# Altium schematic sheet MainProcessor.SchDoc
size 420 x 297 mm; SheetNumber: 1; SheetTotal: 7; ENG_APP_DATE: --/--/--; DSN_APP_DATE: --/--/--; CHK_APP_DATE: --/--/--
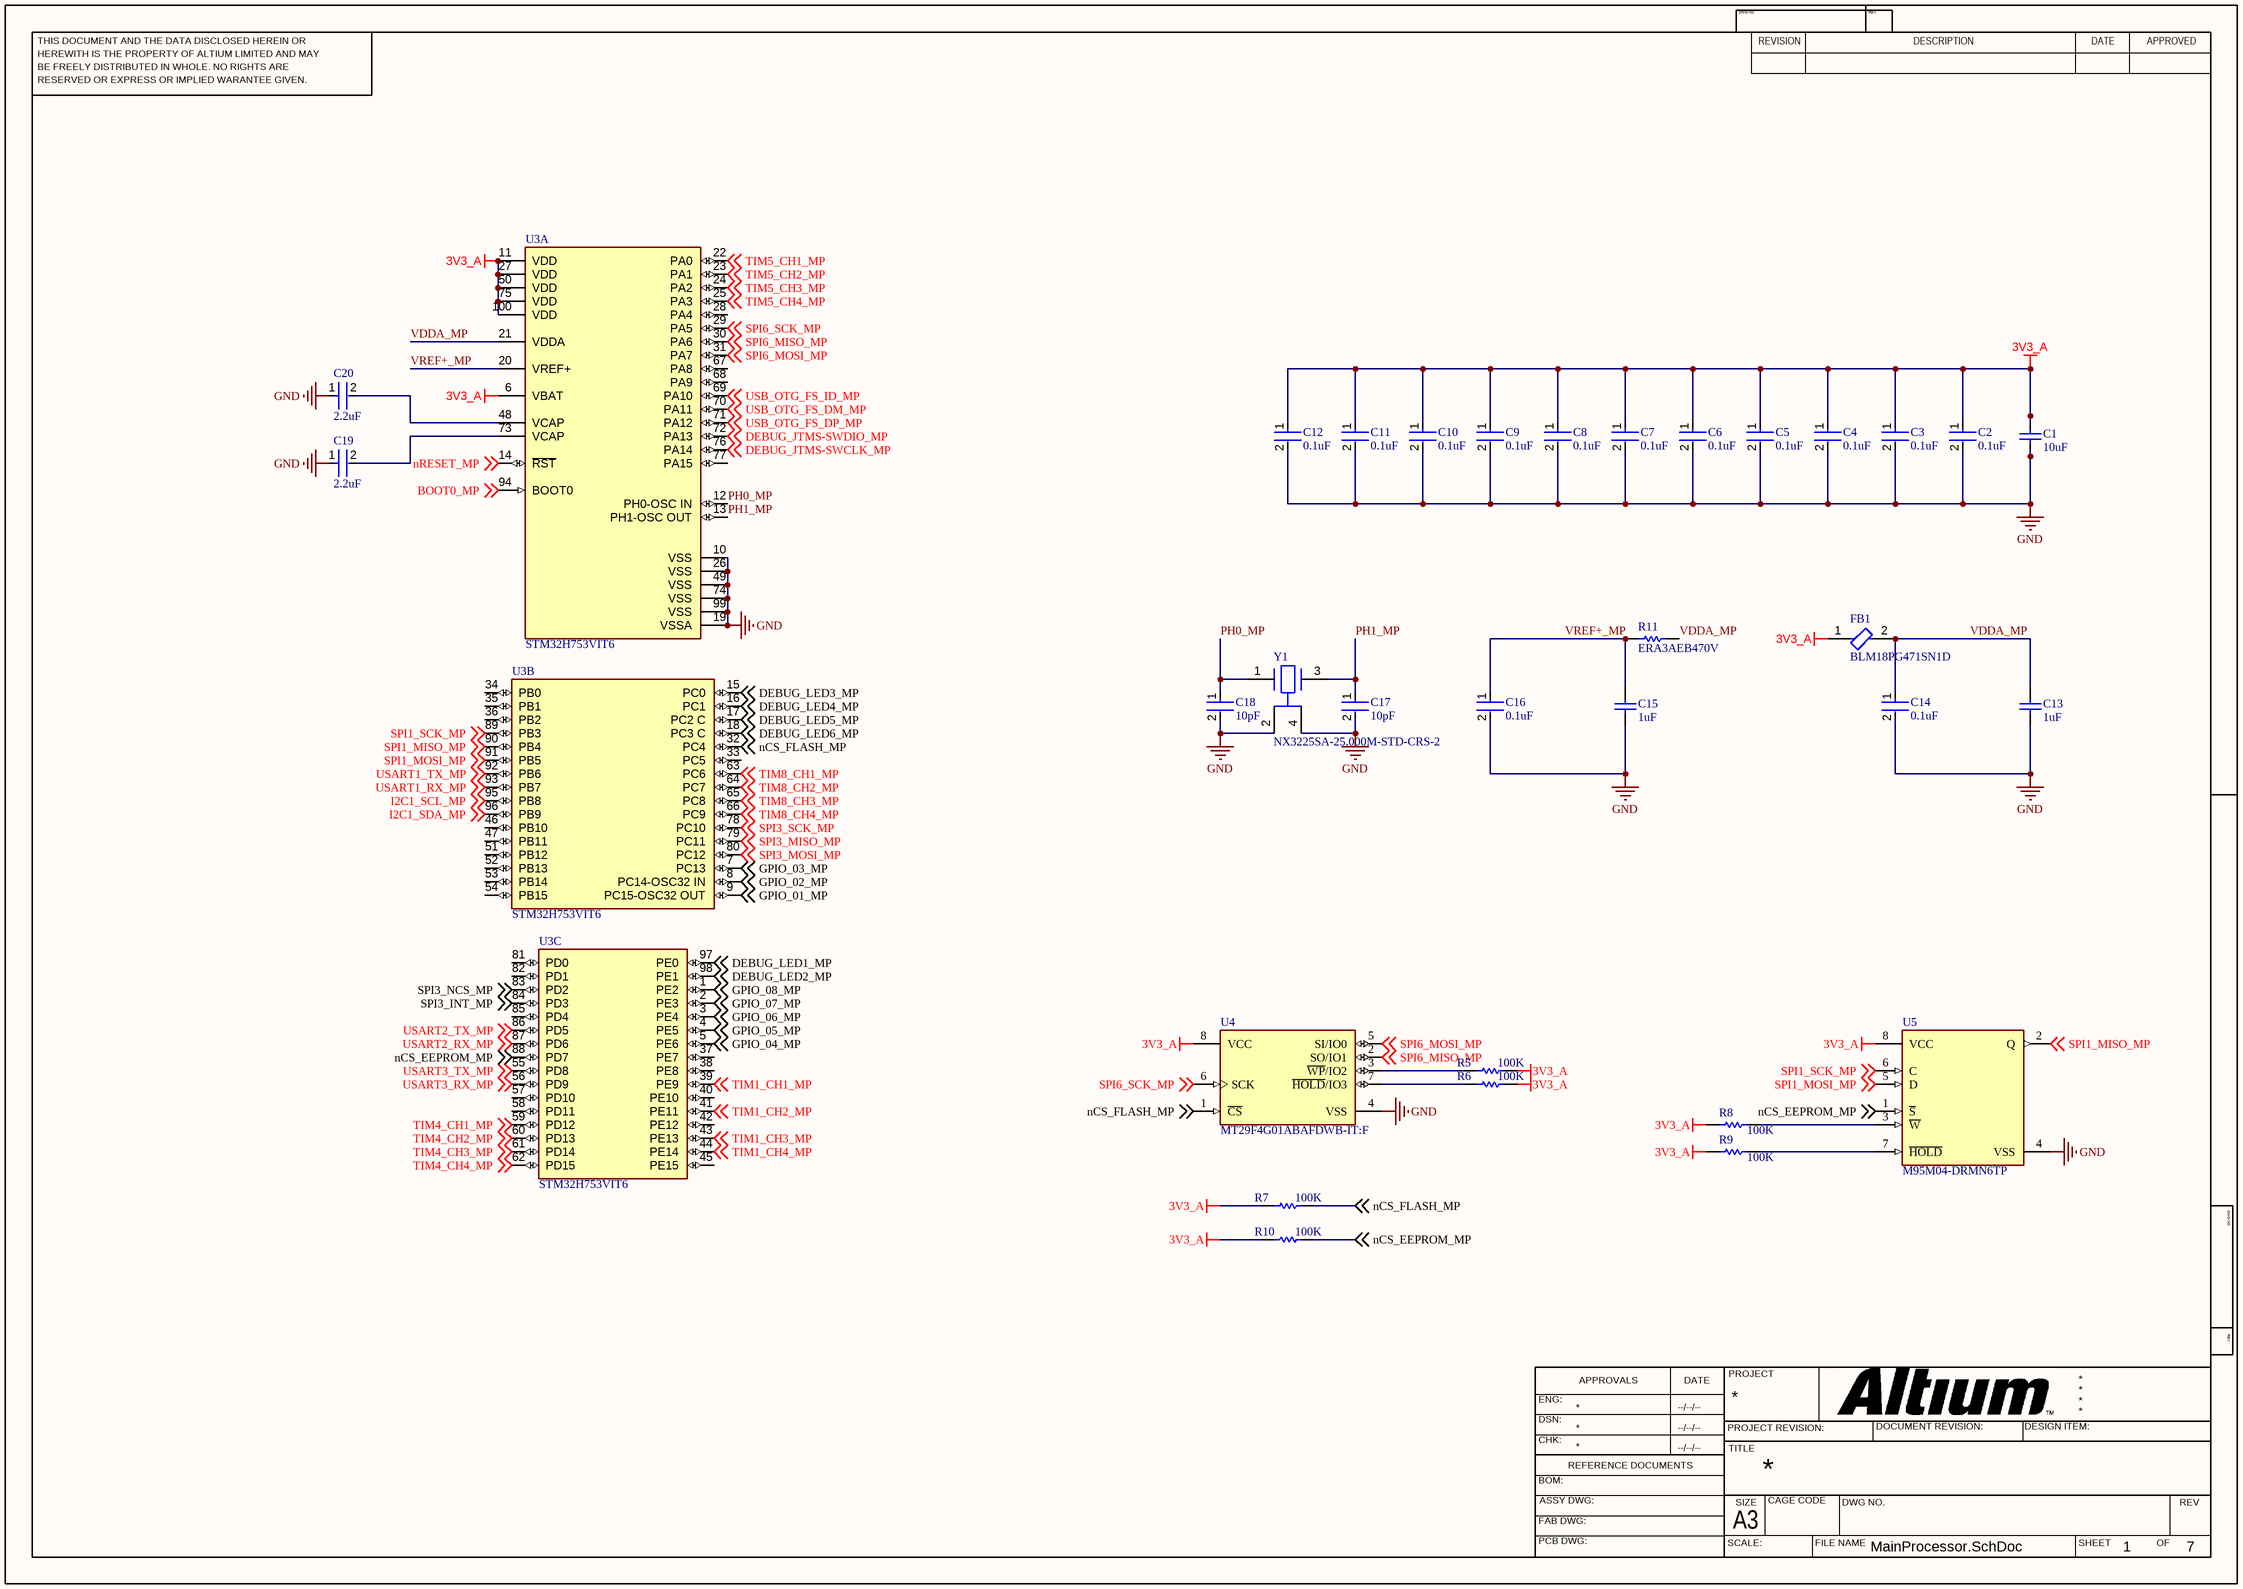
[diagram p0: MainProcessor.SchDoc]

## Parts
C1  10uF  [CAPC2013X145X50LL20T25]
C2  0.1uF  [FP-C0603C-CF-MFG]
C3  0.1uF  [FP-C0603C-CF-MFG]
C4  0.1uF  [FP-C0603C-CF-MFG]
C5  0.1uF  [FP-C0603C-CF-MFG]
C6  0.1uF  [FP-C0603C-CF-MFG]
C7  0.1uF  [FP-C0603C-CF-MFG]
C8  0.1uF  [FP-C0603C-CF-MFG]
C9  0.1uF  [FP-C0603C-CF-MFG]
C10  0.1uF  [FP-C0603C-CF-MFG]
C11  0.1uF  [FP-C0603C-CF-MFG]
C12  0.1uF  [FP-C0603C-CF-MFG]
C13  1uF  [CAPC1608X90X35LL15T15]
C14  0.1uF  [FP-C0603C-CF-MFG]
C15  1uF  [CAPC1608X90X35LL15T15]
C16  0.1uF  [FP-C0603C-CF-MFG]
C17  10pF  [FP-C0603C-CF-MFG]
C18  10pF  [FP-C0603C-CF-MFG]
C19  2.2uF  [FP-GRM188-0_1-e0_2_0_5-MFG]
C20  2.2uF  [FP-GRM188-0_1-e0_2_0_5-MFG]
FB1  BLM18PG471SN1D  [FP-BLM18-0_15-t0_8-MFG]
R5  100K  [RESC1608X55X30ML20T10]
R6  100K  [RESC1608X55X30ML20T10]
R7  100K  [RESC1608X55X30ML20T10]
R8  100K  [RESC1608X55X30ML20T10]
R9  100K  [RESC1608X55X30ML20T10]
R10  100K  [RESC1608X55X30ML20T10]
R11  ERA3AEB470V  [RESC1608X55X30NL20T20]
U3  STM32H753VIT6  [FP-LQFP100-1L-MFG]  (parts A,B,C of 3)
U4  MT29F4G01ABAFDWB-IT:F  [FP-WB-IPC_B]
U5  M95M04-DRMN6TP  [FP-SO8N-SO-A-IPC_C]
Y1  NX3225SA-25.000M-STD-CRS-2  [FP-NX3225SA-MFG]

## Nets
3V3_A: C1.1 C2.1 C3.1 C4.1 C5.1 C6.1 C7.1 C8.1 C9.1 C10.1 C11.1 C12.1 FB1.1 R5.2 R6.2 R7.2 R8.2 R9.2 R10.2 U3.6(VBAT) U3.11(VDD) U3.27(VDD) U3.50(VDD) U3.75(VDD) U3.100(VDD) U4.8(VCC) U5.8(VCC)
GND: C1.2 C2.2 C3.2 C4.2 C5.2 C6.2 C7.2 C8.2 C9.2 C10.2 C11.2 C12.2 C13.2 C14.2 C15.2 C16.2 C17.2 C18.2 C19.1 C20.1 U3.10(VSS) U3.19(VSSA) U3.26(VSS) U3.49(VSS) U3.74(VSS) U3.99(VSS) U4.4(VSS) U5.4(VSS) Y1.2(GND) Y1.4(GND)
BOOT0_MP: U3.94(BOOT0) ; off-sheet BOOT0_MP
DEBUG_JTMS-SWCLK_MP: U3.76(PA14) ; off-sheet DEBUG_JTMS-SWCLK_MP
DEBUG_JTMS-SWDIO_MP: U3.72(PA13) ; off-sheet DEBUG_JTMS-SWDIO_MP
DEBUG_LED1_MP: U3.97(PE0) ; off-sheet DEBUG_LED1_MP
DEBUG_LED2_MP: U3.98(PE1) ; off-sheet DEBUG_LED2_MP
DEBUG_LED3_MP: U3.15(PC0) ; off-sheet DEBUG_LED3_MP
DEBUG_LED4_MP: U3.16(PC1) ; off-sheet DEBUG_LED4_MP
DEBUG_LED5_MP: U3.17(PC2_C) ; off-sheet DEBUG_LED5_MP
DEBUG_LED6_MP: U3.18(PC3_C) ; off-sheet DEBUG_LED6_MP
GPIO_01_MP: U3.9(PC15-OSC32_OUT) ; off-sheet GPIO_01_MP
GPIO_02_MP: U3.8(PC14-OSC32_IN) ; off-sheet GPIO_02_MP
GPIO_03_MP: U3.7(PC13) ; off-sheet GPIO_03_MP
GPIO_04_MP: U3.5(PE6) ; off-sheet GPIO_04_MP
GPIO_05_MP: U3.4(PE5) ; off-sheet GPIO_05_MP
GPIO_06_MP: U3.3(PE4) ; off-sheet GPIO_06_MP
GPIO_07_MP: U3.2(PE3) ; off-sheet GPIO_07_MP
GPIO_08_MP: U3.1(PE2) ; off-sheet GPIO_08_MP
I2C1_SCL_MP: U3.95(PB8) ; off-sheet I2C1_SCL_MP
I2C1_SDA_MP: U3.96(PB9) ; off-sheet I2C1_SDA_MP
nCS_EEPROM_MP: R10.1 U3.88(PD7) U5.1(~{S}) ; off-sheet nCS_EEPROM_MP
nCS_FLASH_MP: R7.1 U3.32(PC4) U4.1(~{CS}) ; off-sheet nCS_FLASH_MP
nRESET_MP: U3.14(~{RST}) ; off-sheet nRESET_MP
PH0_MP: C18.1 U3.12(PH0-OSC_IN) Y1.1
PH1_MP: C17.1 U3.13(PH1-OSC_OUT) Y1.3
SPI1_MISO_MP: U3.90(PB4) U5.2(Q) ; off-sheet SPI1_MISO_MP
SPI1_MOSI_MP: U3.91(PB5) U5.5(D) ; off-sheet SPI1_MOSI_MP
SPI1_SCK_MP: U3.89(PB3) U5.6(C) ; off-sheet SPI1_SCK_MP
SPI3_INT_MP: U3.84(PD3) ; off-sheet SPI3_INT_MP
SPI3_MISO_MP: U3.79(PC11) ; off-sheet SPI3_MISO_MP
SPI3_MOSI_MP: U3.80(PC12) ; off-sheet SPI3_MOSI_MP
SPI3_NCS_MP: U3.83(PD2) ; off-sheet SPI3_NCS_MP
SPI3_SCK_MP: U3.78(PC10) ; off-sheet SPI3_SCK_MP
SPI6_MISO_MP: U3.30(PA6) U4.2(SO/IO1) ; off-sheet SPI6_MISO_MP
SPI6_MOSI_MP: U3.31(PA7) U4.5(SI/IO0) ; off-sheet SPI6_MOSI_MP
SPI6_SCK_MP: U3.29(PA5) U4.6(SCK) ; off-sheet SPI6_SCK_MP
TIM1_CH1_MP: U3.39(PE9) ; off-sheet TIM1_CH1_MP
TIM1_CH2_MP: U3.41(PE11) ; off-sheet TIM1_CH2_MP
TIM1_CH3_MP: U3.43(PE13) ; off-sheet TIM1_CH3_MP
TIM1_CH4_MP: U3.44(PE14) ; off-sheet TIM1_CH4_MP
TIM4_CH1_MP: U3.59(PD12) ; off-sheet TIM4_CH1_MP
TIM4_CH2_MP: U3.60(PD13) ; off-sheet TIM4_CH2_MP
TIM4_CH3_MP: U3.61(PD14) ; off-sheet TIM4_CH3_MP
TIM4_CH4_MP: U3.62(PD15) ; off-sheet TIM4_CH4_MP
TIM5_CH1_MP: U3.22(PA0) ; off-sheet TIM5_CH1_MP
TIM5_CH2_MP: U3.23(PA1) ; off-sheet TIM5_CH2_MP
TIM5_CH3_MP: U3.24(PA2) ; off-sheet TIM5_CH3_MP
TIM5_CH4_MP: U3.25(PA3) ; off-sheet TIM5_CH4_MP
TIM8_CH1_MP: U3.63(PC6) ; off-sheet TIM8_CH1_MP
TIM8_CH2_MP: U3.64(PC7) ; off-sheet TIM8_CH2_MP
TIM8_CH3_MP: U3.65(PC8) ; off-sheet TIM8_CH3_MP
TIM8_CH4_MP: U3.66(PC9) ; off-sheet TIM8_CH4_MP
USART1_RX_MP: U3.93(PB7) ; off-sheet USART1_RX_MP
USART1_TX_MP: U3.92(PB6) ; off-sheet USART1_TX_MP
USART2_RX_MP: U3.87(PD6) ; off-sheet USART2_RX_MP
USART2_TX_MP: U3.86(PD5) ; off-sheet USART2_TX_MP
USART3_RX_MP: U3.56(PD9) ; off-sheet USART3_RX_MP
USART3_TX_MP: U3.55(PD8) ; off-sheet USART3_TX_MP
USB_OTG_FS_DM_MP: U3.70(PA11) ; off-sheet USB_OTG_FS_DM_MP
USB_OTG_FS_DP_MP: U3.71(PA12) ; off-sheet USB_OTG_FS_DP_MP
USB_OTG_FS_ID_MP: U3.69(PA10) ; off-sheet USB_OTG_FS_ID_MP
VDDA_MP: C13.1 C14.1 FB1.2 R11.2 U3.21(VDDA)
VREF+_MP: C15.1 C16.1 R11.1 U3.20(VREF+)
NetC19_2: C19.2 U3.73(VCAP)
NetC20_2: C20.2 U3.48(VCAP)
NetR5_1: R5.1 U4.3(~{WP}/IO2)
NetR6_1: R6.1 U4.7(~{HOLD}/IO3)
NetR8_1: R8.1 U5.3(~{W})
NetR9_1: R9.1 U5.7(~{HOLD})

Not connected (* = marked no-connect by the designer): U3 28(PA4) 33(PC5) 34(PB0) 35(PB1) 36(PB2) 37(PE7) 38(PE8) 40(PE10) 42(PE12) 45(PE15) 46(PB10) 47(PB11) 51(PB12) 52(PB13) 53(PB14) 54(PB15) 57(PD10) 58(PD11) 67(PA8) 68(PA9) 77(PA15) 81(PD0) 82(PD1) 85(PD4)

## Notes on the sheet
- THIS DOCUMENT AND THE DATA DISCLOSED HEREIN OR
- HEREWITH IS THE PROPERTY OF ALTIUM LIMITED AND MAY
- DWG NO:
- REVISION
- REV:
- DESCRIPTION
- DATE
- APPROVED
- BE FREELY DISTRIBUTED IN WHOLE. NO RIGHTS ARE
- RESERVED OR EXPRESS OR IMPLIED WARANTEE GIVEN.
- ENG:
- APPROVALS
- PROJECT
- DSN:
- CHK:
- REFERENCE DOCUMENTS
- PROJECT REVISION:
- TITLE
- DOCUMENT REVISION:
- DESIGN ITEM:
- BOM:
- FAB DWG:
- PCB DWG:
- ASSY DWG:
- SCALE:
- A3
- SIZE
- CAGE CODE
- FILE NAME
- DWG NO.
- SHEET
- OF
- REV

## Library data of the parts
C1 = CMP-2007-01044-1: Manufacturer: Kemet; Part Number: C0805C106K8RACTU
C2-C12 C14 C16 = CMP-2006-03061-2: CAP CER 0.1UF 50V X7R 0603; Manufacturer: KEMET; Manufacturer Part Number: C0603C104K5RACTU; Tolerance: 0.1; Temperature Coefficient: 30ppm/°C; Material: Ceramic; Automotive Grade: Grade 1; Value: 0.10 μF; Temperature: -55°C to +125°C; RoHS: TRUE; Temperature Range High: +125°C; Lead Free: Yes; Octopart: https://octopart.com/c0603c104k5ractu-kemet-139244; Digikey Description: CAP CER 0.1UF 50V X7R 0603; Category: Cap; Package: C0603C-CF; ComponentLink2Description: Datasheet; Temperature Range Low: -55°C; Device Class L1: Passive Components; Voltage Rating: 50 V; Automotive: Yes; Device Class L3: Ceramic Capacitors; ComponentLink2URL: https://api.kemet.com/component-edge/download/datasheet/C0603C100J5GACAUTO.pdf; Capacitance: 0.10 μF; Device Class L2: Capacitors; Temperature Characteristic: X7R; Height: 0.87mm
C13 C15 = CMP-2006-02298-2: Manufacturer: Kemet; Part Number: C0603C105K4RACTU
C17 C18 = CMP-2006-03343-2: CAP CER 10PF 50V NP0 0603; Manufacturer: KEMET; Manufacturer Part Number: C0603C100C5GACTU; Material: Ceramic; Temperature Coefficient: 30ppm/°C; Automotive Grade: Grade 1; Tolerance: 0.25 pF; Temperature Characteristic: C0G; Device Class L3: Ceramic Capacitors; Value: 10 pF; Device Class L1: Passive Components; Lead Free: Yes; RoHS: TRUE; Voltage Rating: 50 V; Automotive: Yes; Capacitance: 10 pF; Height: 0.87mm; Temperature Range Low: -55°C; Temperature Range High: +125°C; Mouser Description: Multilayer Ceramic Capacitors MLCC - SMD/SMT 50volts 10pF C0G 0.25%; Device Class L2: Capacitors; Digikey Description: CAP CER 10PF 50V NP0 0603; ComponentLink2Description: Datasheet; Package: C0603C-CF; ComponentLink2URL: https://api.kemet.com/component-edge/download/datasheet/C0603C100J5GACAUTO.pdf; Category: Cap; Octopart: https://octopart.com/c0603c100c5gactu-kemet-9138556; Temperature: -55°C to +125°C
C19 C20 = CMP-2006-02836-2: Chip Multilayer Ceramic Capacitors for General Purpose, 0603, 2.2uF, X7R, 15%, 10%, 10V; Case Code (Metric): 1608; Height: 0.8mm; Packaging: Cut Tape; Voltage: 10V; Lead Free: Lead Free; Min Operating Temperature: -55°C; Voltage Rating (DC): 10V; Max Operating Temperature: 125°C; Voltage Rating: 10V; Dielectric: X7R; Depth: 0.8mm; Case Code (Imperial): 0603; Termination: SMD/SMT; Case/Package: 0603; Number of Pins: 2; REACH SVHC: No SVHC; Mount: Surface Mount; Width: 0.031inch; Material: Ceramic; Capacitance: 2.2uF; Package Quantity: 1; Weight: 7.1E-05oz; Length: 1.6mm; Thickness: 0.035inch; Tolerance: 10%
FB1 = CMP-0686-00587-3: Chip Ferrite Bead, 0603, 470Ω @ 100MHz, 0.2Ω, 25%, 1A; DC Resistance (DCR): 200mR; Number of Circuits: 1; Material: Steel; Impedance: 470R; Core Material: Ferrite; Width: 0.8mm; Termination: SMD/SMT; Series: BLM18P; Min Operating Temperature: -55°C; DC Resistance-Max: 200mR; Current Rating: 1A; Package Quantity: 1; Max Operating Temperature: 125°C; Military Standard: Not; REACH SVHC: No SVHC; Max Current Rating: 1A; Number of Pins: 2; RoHS Compliant: Yes; Tolerance: 25%; Packaging: Tape and Reel; Number of Lines: 1; Resistance: 200mR; Length: 1.6mm; Case Code (Metric): 1608; Depth: 0.8mm; Lead Free: Lead Free; Case/Package: 0603; Height: 0.8mm; Radiation Hardening: No; Test Frequency: 100MHz; Case Code (Imperial): 0603; Max DC Current: 1A; DC Current: 1A
R5-R10 = CMP-2000-01852-1: Part Number: RK73B1JTTD104J; Manufacturer: KOA Speer
R11 = CMP-2000-00070-1: Manufacturer: Panasonic; Part Number: ERA3AEB470V
U3 = CMP-12105-000037-1: LQFP 100 14X14X1.4; Manufacturer: STMicroelectronics; Number Of Cores: 1; Interface: I2C,SPI,UART,USART,CAN,USB,Ethernet,I2S,Other; Standoff Height: 0.05mm; Number Of Pwm Channels: 2; Number Of Timers/Counters: 20; Number Of A/D Converters: 5; Number Of Uart Channels: 4; Memory Type: FLASH; Number Of Spi Channels: 6; Core Architecture: ARM Cortex-M7; Max Junction Temp: +125°C; Max Supply Voltage: 3.6V; Number Of Adc Channels: 36; Data Bus Width: 32bits; Number Of I/Os: 82; Ram Size: 1MBytes; Frequency: 480MHz; Memory Size: 2MBytes; Min Supply Voltage: 1.71V; Lead Free: Yes; Octopart: https://octopart.com/stm32h753vit6-stmicroelectronics-87879769; Category: IC; Digikey Description: LQFP 100 14X14X1.4; ComponentLink2Description: Datasheet; RoHS: TRUE; Device Class L1: Integrated Circuits (ICs); Mouser Description: MCU 32-Bit STM32 ARM Cortex M7 RISC 2MB Flash 1.8V/2.5V/3.3V 100-Pin LQFP Tray; ComponentLink2URL: https://www.st.com/resource/en/datasheet/stm32h753vi.pdf; Ambient Temperature Range Low: -40°C; Device Class L3: Microcontrollers; Ambient Temperature Range High: +85°C; Temperature Range Low: -40°C; Height: 1.6mm; Temperature Range High: +85°C; Automotive: No; Number Of I2C Channels: 4; Temperature: -40°C to +85°C; Ipc Land Pattern Name: QFP50P1600X1600X160-100; Manufacturer Part Number: STM32H753VIT6; Device Class L2: Embedded Processors and Controllers; Package: LQFP100-1L
U4 = CMP-14958-000017-1: IC FLASH 4GBIT SPI UPDFN; Memory Type: Non-Volatile; Memory Size: 4Gb; Min Operating Temperature: -40°C; Packaging: Box; Series: -; Max Operating Temperature: 85°C
U5 = CMP-12142-000020-1: STANDARD SERIAL EEPROM; RoHS Compliant: Yes
Y1 = CMP-200220-000002-1: CRYSTAL 25.0000MHZ 8PF SMD; Manufacturer: NDK; Frequency: 25MHz; Automotive Grade: Grade 1; Esr: 100Ω; Tolerance: 15ppm; Digikey Description: CRYSTAL 25.0000MHZ 8PF SMD; Temperature Range Low: -40°C; Octopart: https://octopart.com/nx3225sa-25.000m-std-crs-2-ndk-51374293; Series: NX3225SA; Manufacturer Part Number: NX3225SA-25.000M-STD-CRS-2; ComponentLink2URL: https://www.ndk.com/images/products/catalog/c_NX3225SA-STD-CRS-2_e.pdf; Lead Free: Yes; Device Class L2: Crystals / Oscillators; ComponentLink2Description: Datasheet; Device Class L3: Crystals; Category: Crys; Device Class L1: Passive Components; Automotive: Yes; RoHS: TRUE; Load Capacitance: 8pF; Height: 0.6mm; Temperature Range High: +125°C; Package: NX3225SA; Temperature: -40°C to +125°C